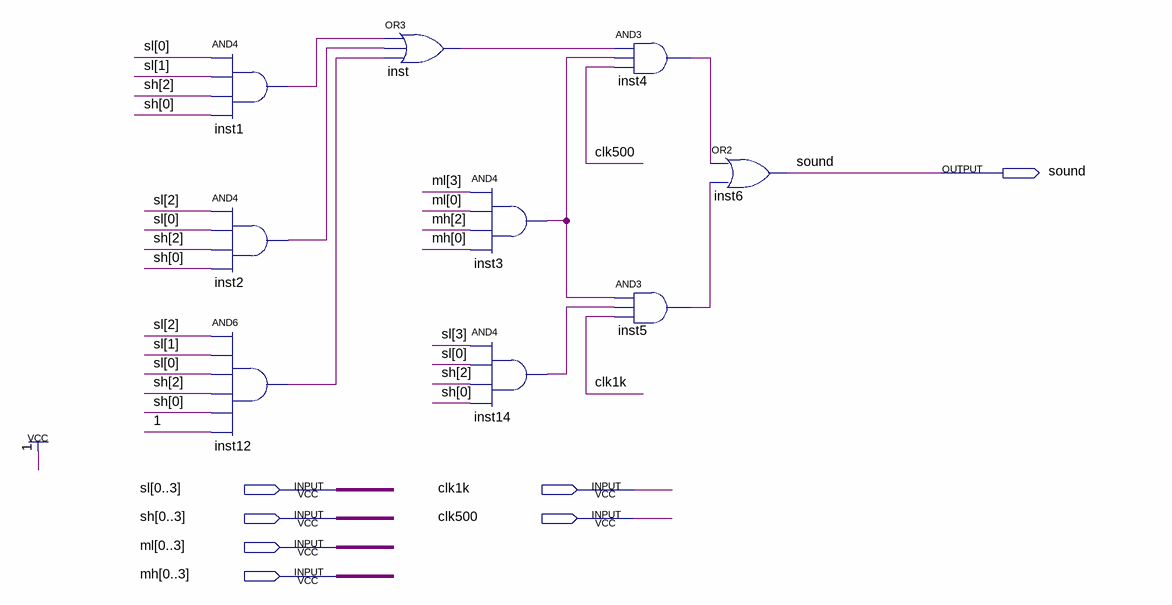
[diagram p0: schematic sheet]
// Quartus schematic bell.bdf as structural Verilog: 9 symbols, 7 pins
module bell (
  input  [0:3] sl,
  input  clk1k,
  input  [0:3] sh,
  input  clk500,
  input  [0:3] ml,
  input  [0:3] mh,
  output sound
);

  wire inst1_out, inst2_out, inst3_out, inst4_out, inst5_out, inst12_out, inst14_out, inst_out;

  and inst1 (inst1_out, sl[0], sl[1], sh[2], sh[0]);
  and inst2 (inst2_out, sl[2], sl[0], sh[2], sh[0]);
  and inst12 (inst12_out, sl[2], sl[1], sl[0], sh[2], sh[0], 1'b1);
  or inst (inst_out, inst1_out, inst2_out, inst12_out);
  and inst3 (inst3_out, ml[3], ml[0], mh[2], mh[0]);
  and inst14 (inst14_out, sl[3], sl[0], sh[2], sh[0]);
  and inst4 (inst4_out, inst_out, inst3_out, clk500);
  and inst5 (inst5_out, inst3_out, inst14_out, clk1k);
  or inst6 (sound, inst4_out, inst5_out);
endmodule
